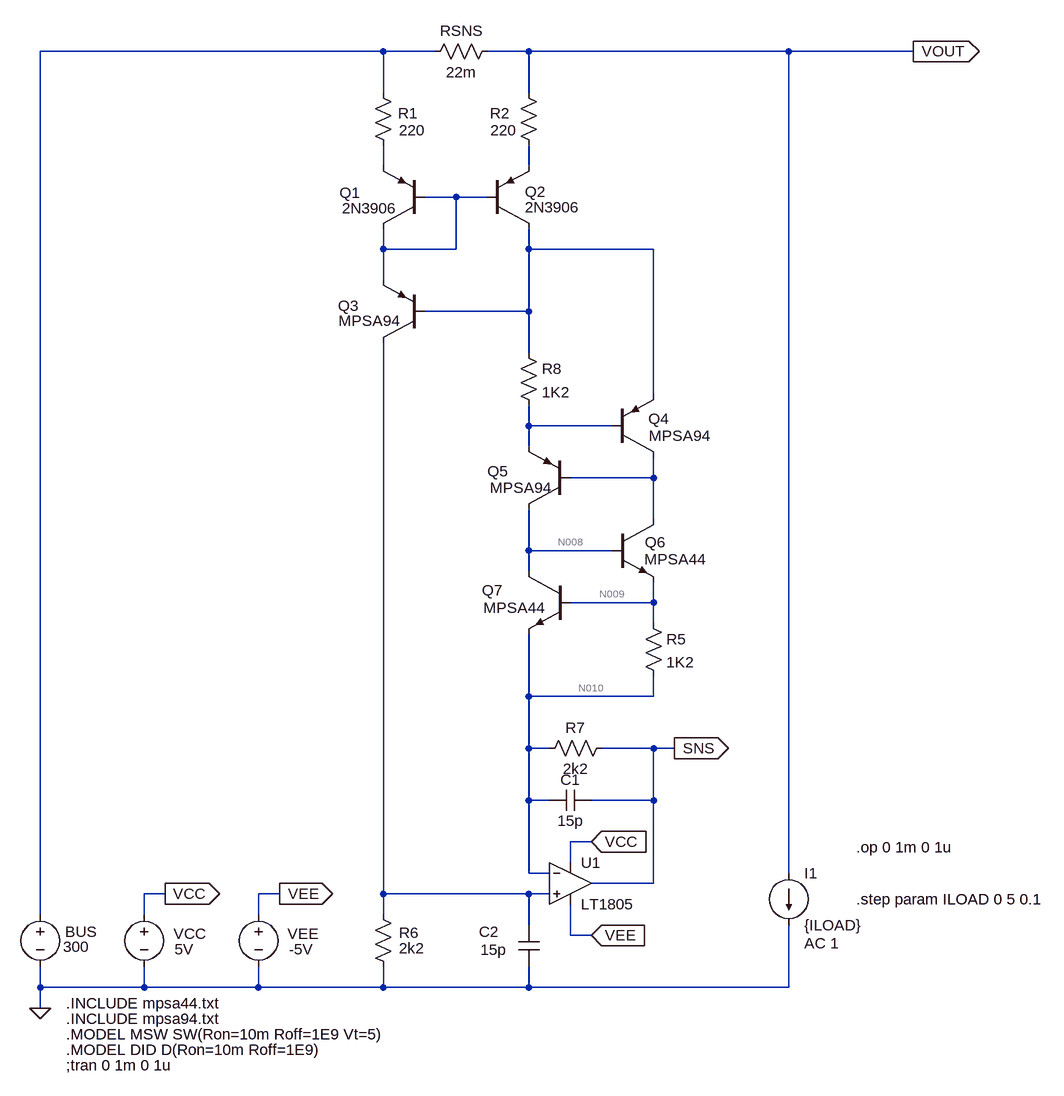
[diagram p0: schematic isense01_neg_rail_param.asc]
* isense01_neg_rail_param.asc
RSNS VOUT N001 22m
R1 N001 N002 220
R2 VOUT N003 220
Q1 N004 N004 N002 0 2N3906
Q2 N005 N004 N003 0 2N3906
R6 N011 0 2k2
R7 SNS N010 2k2
V§BUS N001 0 300
Q7 N008 N009 N010 0 MPSA44
R8 N005 N006 1K2
R5 N009 N010 1K2
Q3 N011 N005 N004 0 MPSA94
VCC VCC 0 5V
C1 SNS N010 15p
C2 0 N011 15p
Q5 N008 N007 N006 0 MPSA94
Q4 N007 N006 N005 0 MPSA94
Q6 N007 N008 N009 0 MPSA44
I1 VOUT 0 {ILOAD} AC 1
VEE VEE 0 -5V
* U1: LT1805 (symbol Opamps\LT1805 not available, pins judged from their places): In+=N011 In-=N010 V+=VCC V-=VEE OUT=SNS
.model NPN NPN
.model PNP PNP
.lib standard.bjt
.MODEL MSW SW(Ron=10m Roff=1E9 Vt=5)
.MODEL DID D(Ron=10m Roff=1E9)
;tran 0 1m 0 1u
.INCLUDE mpsa44.txt
.INCLUDE mpsa94.txt
.step param ILOAD 0 5 0.1
.op 0 1m 0 1u
.backanno
.end

* Results of the author's LTspice run, read from the files saved beside the schematic
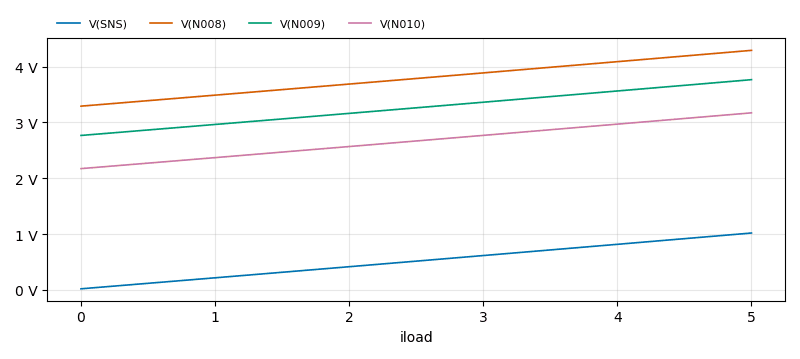
[diagram p1: Operating Point of isense01_neg_rail_param.asc, plotted from the saved traces]
* Operating Point, 1 run:
*   V(SNS): 20.13 mV at iload=0, 1.019 V at iload=5 , min 20.13 mV, max 1.019 V
*   V(N008): 3.292 V at iload=0, 4.292 V at iload=5 , min 3.292 V, max 4.292 V
*   V(N009): 2.767 V at iload=0, 3.767 V at iload=5 , min 2.767 V, max 3.767 V
*   V(N010): 2.173 V at iload=0, 3.173 V at iload=5 , min 2.173 V, max 3.173 V
* From the log:
*   Semiconductor Device Operating Points:
*                           --- Diodes ---
*   Name:    d:u1:3      d:u1:16     d:u1:15     d:u1:14     d:u1:7
*   Model:  u1:dbia2    u1:dbia2     u1:din     u1:dlimp2     u1:dp
*   Id:       1.25e-7     1.25e-7      NaN         NaN        1.70e-3
*   Vd:       1.71e+0     1.71e+0    -9.70e-6     3.55e-1     1.00e+1
*   Req:      1.00e-3     1.00e-3      NaN        2.50e-8     1.00e-3
*   CAP:      0.00e+0     0.00e+0     0.00e+0     0.00e+0     0.00e+0
*   Name:    d:u1:2      d:u1:1      d:u1:13     d:u1:12     d:u1:6
*   Model:   u1:desd     u1:desd     u1:desd     u1:desd    u1:dlimn2
*   Id:        NaN         NaN         NaN         NaN         NaN
*   Vd:      -7.17e+0    -7.17e+0    -2.83e+0    -2.83e+0     4.24e-1
*   Req:       NaN         NaN         NaN         NaN        1.00e-8
*   CAP:      0.00e+0     0.00e+0     0.00e+0     0.00e+0     0.00e+0
*   Name:    d:u1:11     d:u1:10     d:u1:8      d:u1:5      d:u1:4
*   Model:  u1:dbia1    u1:dbia1    u1:dlimp1   u1:dlimn1   u1:dbia3
*   Id:        NaN         NaN         NaN         NaN        8.91e-5
*   Vd:      -1.71e+0    -1.71e+0     3.55e-1     4.24e-1     1.11e+0
*   Req:       NaN         NaN        1.00e-9      NaN        1.00e-2
*   CAP:      0.00e+0     0.00e+0     0.00e+0     0.00e+0     0.00e+0
*                           --- Bipolar Transistors ---
*   Name:       q4          q5          q3          q6          q7
*   Model:    mpsa94      mpsa94      mpsa94      mpsa44      mpsa44
*   Ib:       -6.13e-6     1.94e-7    -9.23e-8     4.64e-7     6.50e-6
*   Ic:       -5.01e-4    -4.78e-4    -9.88e-4     5.01e-4     4.77e-4
*   Vbe:      -5.65e-1    -4.77e-1    -4.96e-1     5.25e-1     5.94e-1
*   Vbc:       4.77e-1     2.94e+2     2.96e+2    -2.94e+2    -5.25e-1
*   Vce:      -1.04e+0    -2.95e+2    -2.97e+2     2.95e+2     1.12e+0
*   BetaDC:    8.17e+1    -2.47e+3     1.07e+4     1.08e+3     7.34e+1
*   Gm:        1.92e-2     1.84e-2     3.81e-2     1.96e-2     1.84e-2
*   Rpi:       4.34e+3     9.08e+4     4.84e+4     5.62e+4     4.00e+3
*   Rx:        1.12e+1     1.12e+1     1.12e+1     2.48e+1     2.26e+1
*   Ro:        2.10e+4     6.38e+5     3.10e+5     6.27e+5     4.28e+4
*   Cbe:        NaN         NaN         NaN         NaN         NaN
*   Cbc:        NaN         NaN         NaN         NaN         NaN
*   Cjs:       0.00e+0     0.00e+0     0.00e+0     0.00e+0     0.00e+0
*   BetaAC:    8.32e+1     1.67e+3     1.84e+3     1.10e+3     7.38e+1
*   Cbx:       0.00e+0     0.00e+0     0.00e+0     0.00e+0     0.00e+0
*   Ft:        1.20e+7     1.29e+7     1.85e+7     6.65e+6     5.55e+6
*   Name:       q2          q1
*   Model:    2n3906      2n3906
*   Ib:       -4.88e-6    -4.90e-6
*   Ic:       -9.78e-4    -9.78e-4
*   Vbe:      -6.55e-1    -6.55e-1
*   Vbc:       4.96e-1     0.00e+0
*   Vce:      -1.15e+0    -6.55e-1
*   BetaDC:    2.01e+2     2.00e+2
*   Gm:        3.77e-2     3.77e-2
*   Rpi:       5.30e+3     5.28e+3
*   Rx:        2.00e+1     2.00e+1
*   Ro:        1.03e+5     1.02e+5
*   Cbe:        NaN         NaN
*   Cbc:        NaN         NaN
*   Cjs:       0.00e+0     0.00e+0
*   BetaAC:    2.00e+2     1.99e+2
*   Cbx:       0.00e+0     0.00e+0
*   Ft:        1.84e+8     1.80e+8
*                           --- VDMOSFET Transistors ---
*   Name:        m:u1:2      m:u1:1
*   Model:        u1:pi       u1:ni
*   Id:          -2.38e-4     1.22e-3
*   Vgs:         -3.55e-1     4.24e-1
*   Vds:         -4.98e+0     5.02e+0
*   Vth:         -3.00e-1     3.00e-1
*   Gm:           8.66e-3     1.96e-2
*   Gds:          2.27e-6     1.16e-5
*   Cgs:          0.00e+0     0.00e+0
*   Cgd:          0.00e+0     0.00e+0
*   Cbody:        0.00e+0     0.00e+0